# Altium schematic sheet 主板.SchDoc
size A2
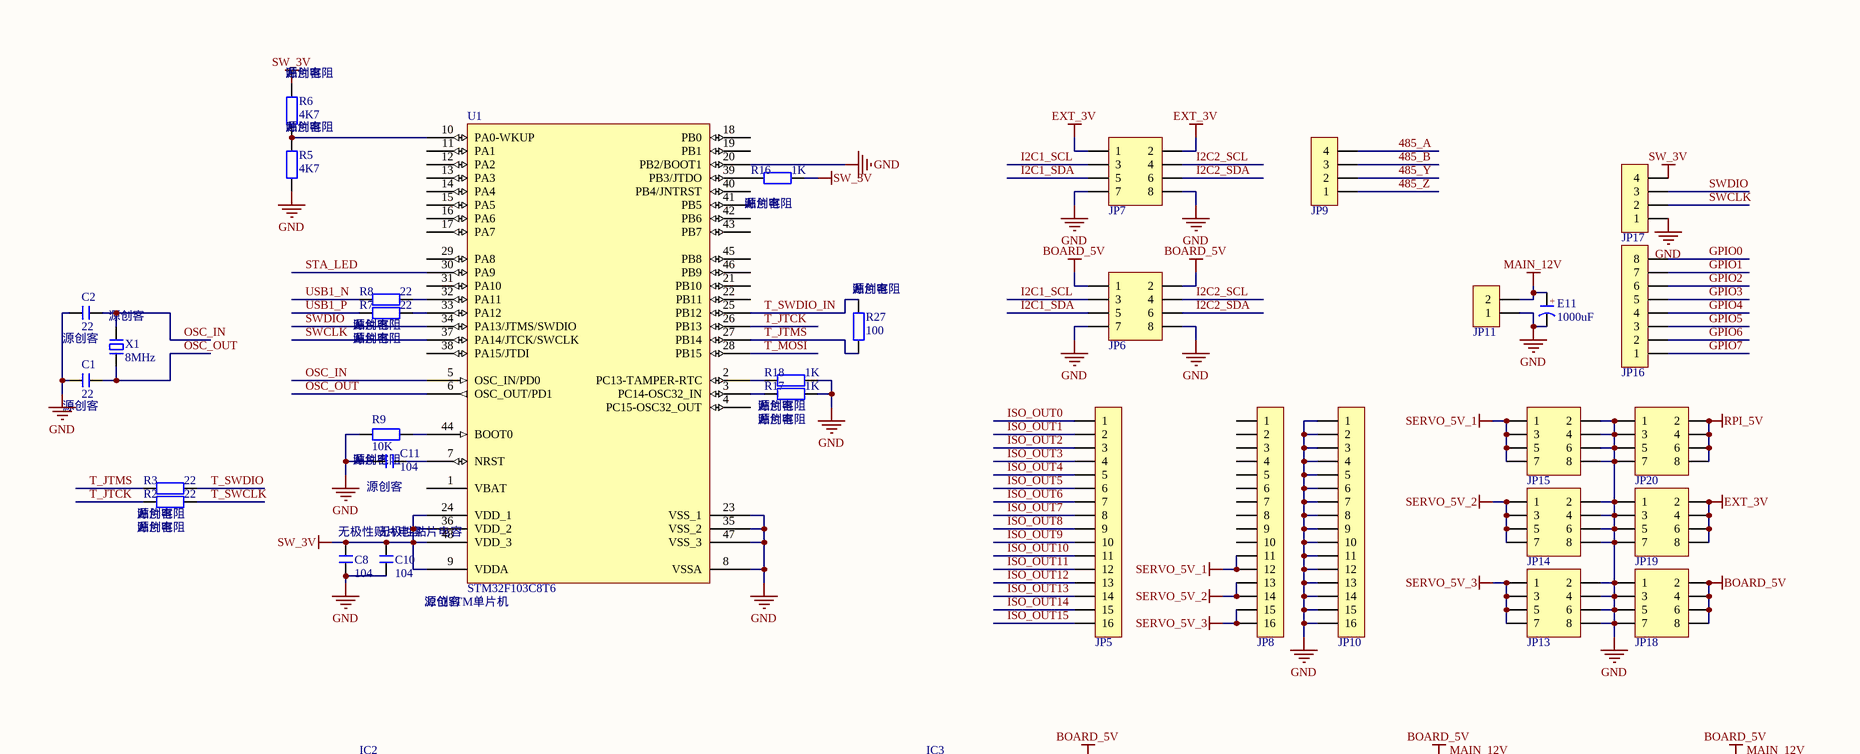
[diagram p0: 主板.SchDoc, top left]
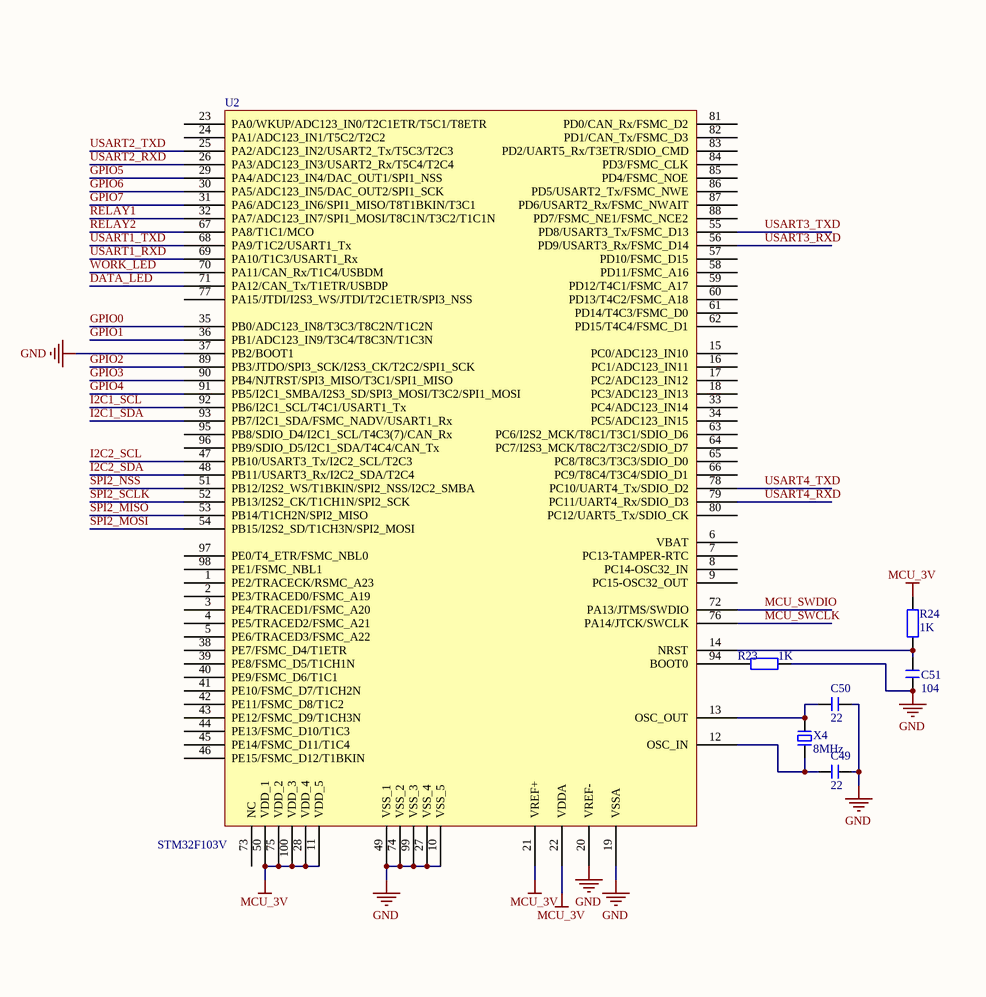
[diagram p1: 主板.SchDoc, top right]
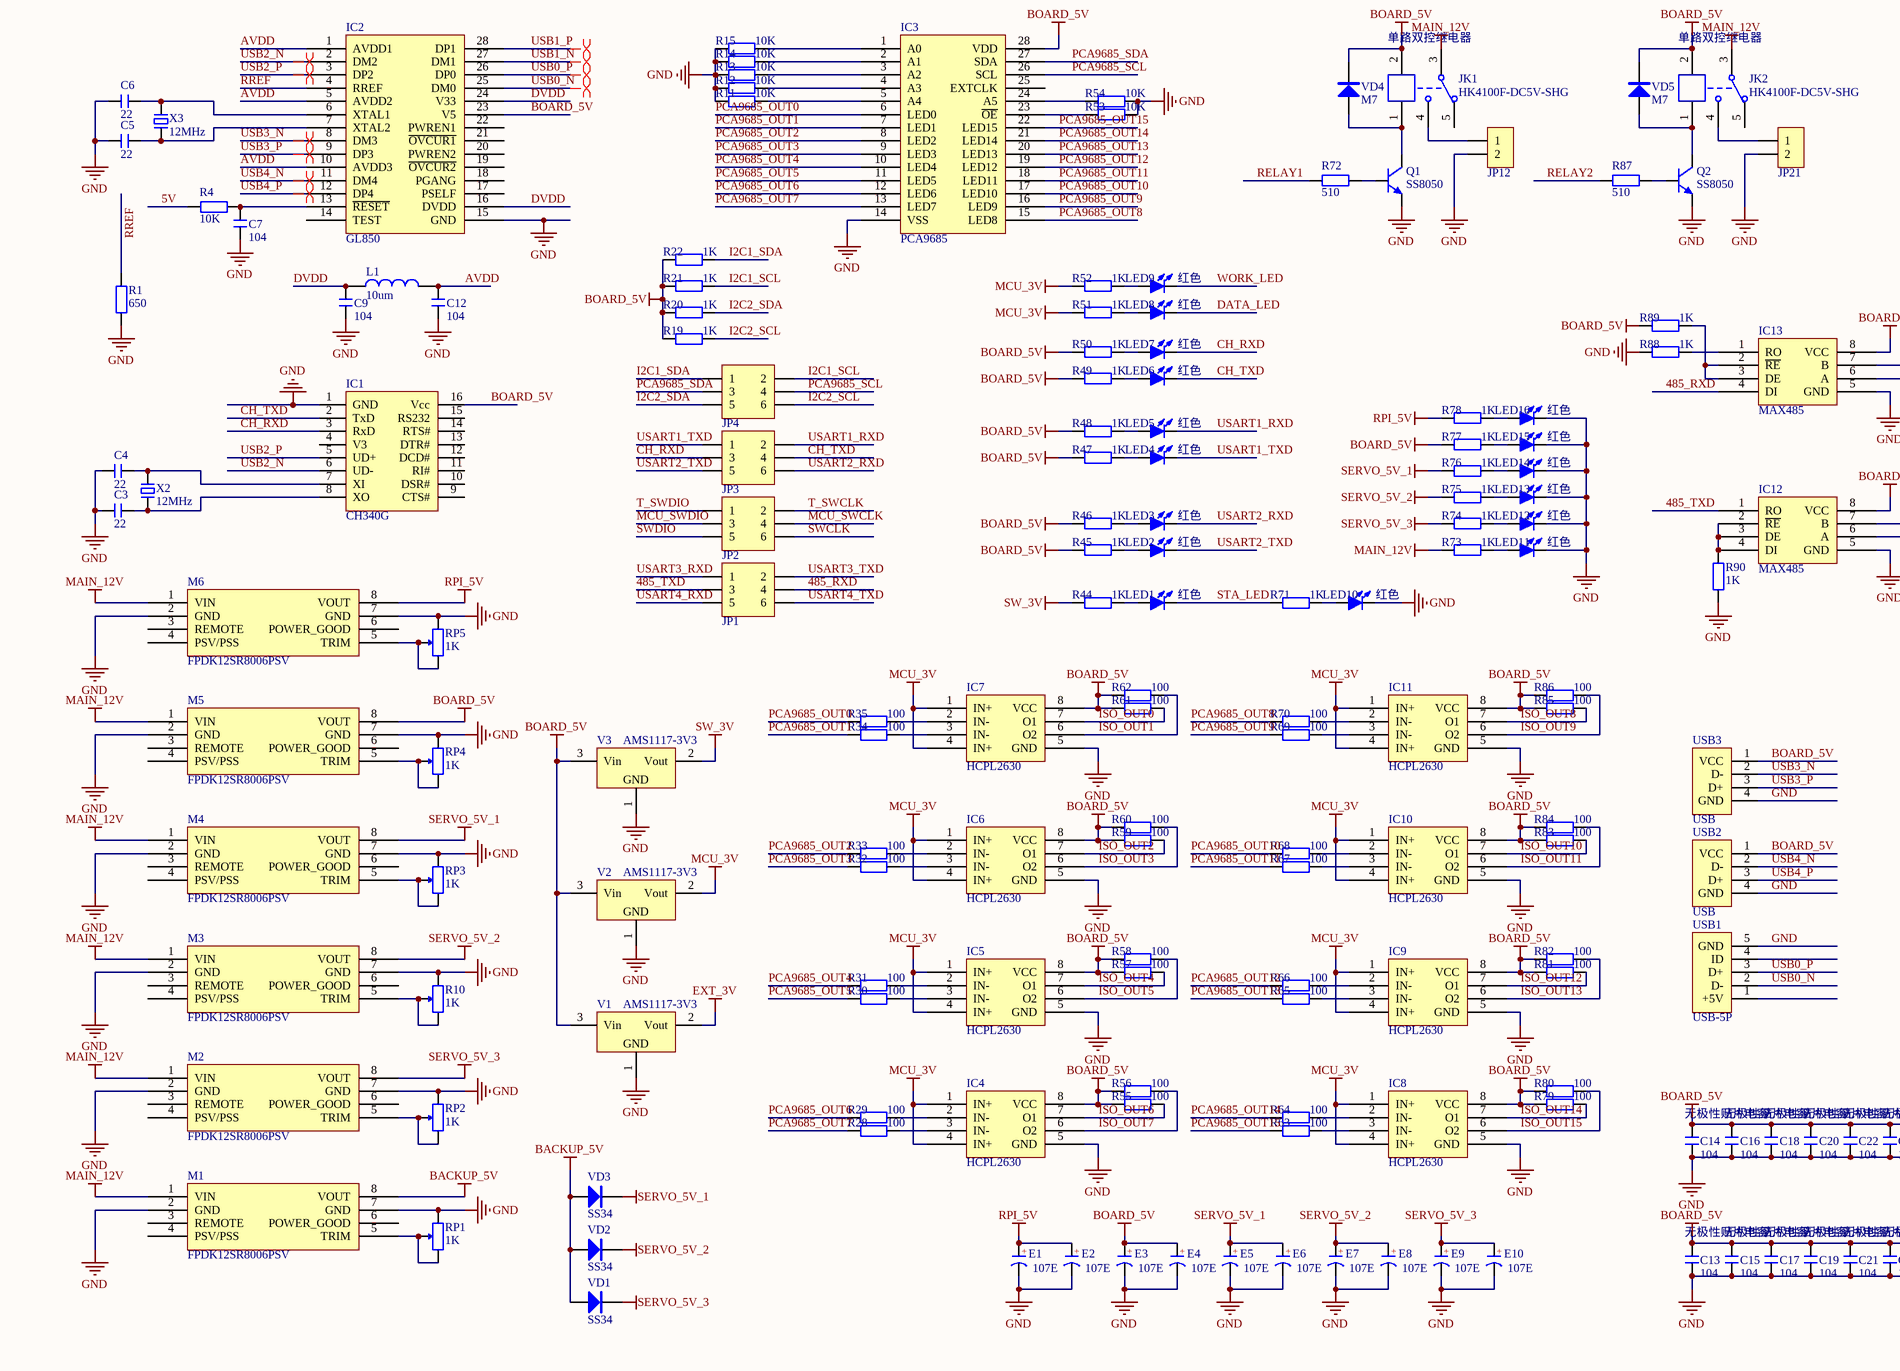
[diagram p2: 主板.SchDoc, bottom left]
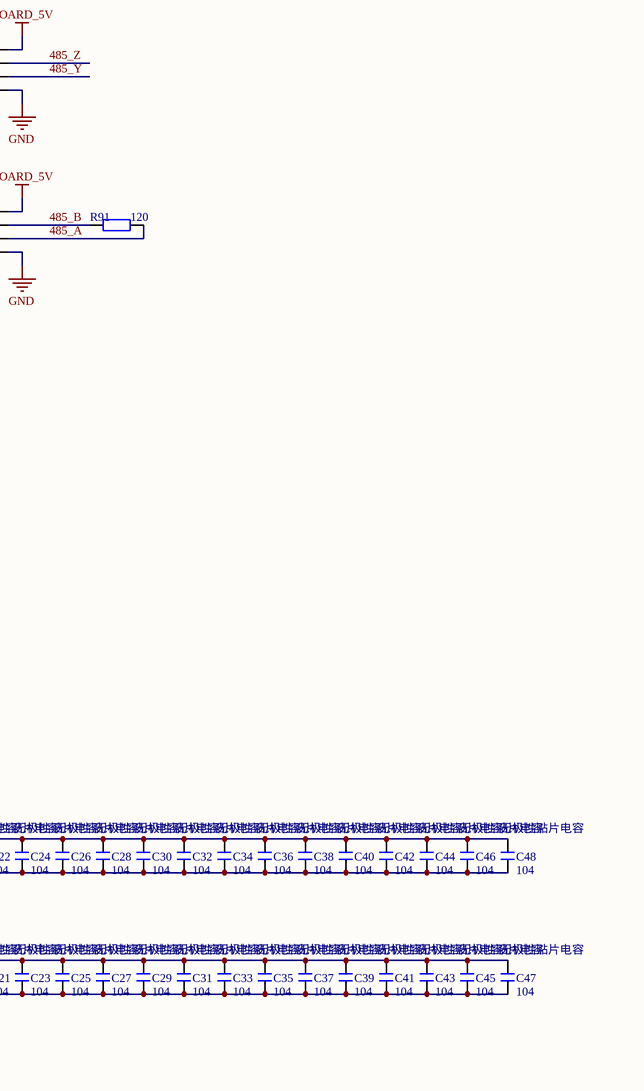
[diagram p3: 主板.SchDoc, bottom right]

## Parts
C1  22  [C 0201]
C2  22  [C 0201]
C3  22  [C 0201]
C4  22  [C 0201]
C5  22  [C 0201]
C6  22  [C 0201]
C7  104  [C 0201]
C8  104  [C 0201]
C9  104  [C 0201]
C10  104  [C 0201]
C11  104  [C 0201]
C12  104  [C 0201]
C13  104  [C 0201]
C14  104  [C 0201]
C15  104  [C 0201]
C16  104  [C 0201]
C17  104  [C 0201]
C18  104  [C 0201]
C19  104  [C 0201]
C20  104  [C 0201]
C21  104  [C 0201]
C22  104  [C 0201]
C23  104  [C 0201]
C24  104  [C 0201]
C25  104  [C 0201]
C26  104  [C 0201]
C27  104  [C 0201]
C28  104  [C 0201]
C29  104  [C 0201]
C30  104  [C 0201]
C31  104  [C 0201]
C32  104  [C 0201]
C33  104  [C 0201]
C34  104  [C 0201]
C35  104  [C 0201]
C36  104  [C 0201]
C37  104  [C 0201]
C38  104  [C 0201]
C39  104  [C 0201]
C40  104  [C 0201]
C41  104  [C 0201]
C42  104  [C 0201]
C43  104  [C 0201]
C44  104  [C 0201]
C45  104  [C 0201]
C46  104  [C 0201]
C47  104  [C 0201]
C48  104  [C 0201]
C49  22  [C 0201]
C50  22  [C 0201]
C51  104  [C 0201]
E1  107E  [CD A(3216)]
E2  107E  [CD A(3216)]
E3  107E  [CD A(3216)]
E4  107E  [CD A(3216)]
E5  107E  [CD A(3216)]
E6  107E  [CD A(3216)]
E7  107E  [CD A(3216)]
E8  107E  [CD A(3216)]
E9  107E  [CD A(3216)]
E10  107E  [CD A(3216)]
E11  1000uF  [CS 2.0*5*8 - C]
IC1  CH340G  [SOP16_L]
IC2  GL850  [SSOP28_M]
IC3  PCA9685  [TSSOP28_M]
IC4  HCPL2630  [DIP8-300]
IC5  HCPL2630  [DIP8-300]
IC6  HCPL2630  [DIP8-300]
IC7  HCPL2630  [DIP8-300]
IC8  HCPL2630  [DIP8-300]
IC9  HCPL2630  [DIP8-300]
IC10  HCPL2630  [DIP8-300]
IC11  HCPL2630  [DIP8-300]
IC12  MAX485  [SOP8W_M]
IC13  MAX485  [SOP8W_M]
JK1  HK4100F-DC5V-SHG  [HK4100F]
JK2  HK4100F-DC5V-SHG  [HK4100F]
JP1  Header3X2  [HDR-3X2]  (value not drawn)
JP2  Header3X2  [HDR-3X2]  (value not drawn)
JP3  Header3X2  [HDR-3X2]  (value not drawn)
JP4  Header3X2  [HDR-3X2]  (value not drawn)
JP5  HDR-1X16  [HDR-1X16]  (value not drawn)
JP6  Header 4X2  [HDR-4X2]  (value not drawn)
JP7  Header 4X2  [HDR-4X2]  (value not drawn)
JP8  HDR-1X16  [HDR-1X16]  (value not drawn)
JP9  HDR-1X4  [HDR-1X4]  (value not drawn)
JP10  HDR-1X16  [HDR-1X16]  (value not drawn)
JP11  HDR-1X2  [HDR-1X2]  (value not drawn)
JP12  HDR-1X2  [HDR-1X2]  (value not drawn)
JP13  Header 4X2  [HDR-4X2]  (value not drawn)
JP14  Header 4X2  [HDR-4X2]  (value not drawn)
JP15  Header 4X2  [HDR-4X2]  (value not drawn)
JP16  HDR-1X8  [HDR-1X8]  (value not drawn)
JP17  HDR-1X4  [HDR-1X4]  (value not drawn)
JP18  Header 4X2  [HDR-4X2]  (value not drawn)
JP19  Header 4X2  [HDR-4X2]  (value not drawn)
JP20  Header 4X2  [HDR-4X2]  (value not drawn)
JP21  HDR-1X2  [HDR-1X2]  (value not drawn)
L1  10um  [L 0402]
LED1  红色  [LED 0603W]
LED2  红色  [LED 0603W]
LED3  红色  [LED 0603W]
LED4  红色  [LED 0603W]
LED5  红色  [LED 0603W]
LED6  红色  [LED 0603W]
LED7  红色  [LED 0603W]
LED8  红色  [LED 0603W]
LED9  红色  [LED 0603W]
LED10  红色  [LED 0603W]
LED11  红色  [LED 0603W]
LED12  红色  [LED 0603W]
LED13  红色  [LED 0603W]
LED14  红色  [LED 0603W]
LED15  红色  [LED 0603W]
LED16  红色  [LED 0603W]
M1  FPDK12SR8006PSV  [FPDK12SR8006PSV]
M2  FPDK12SR8006PSV  [FPDK12SR8006PSV]
M3  FPDK12SR8006PSV  [FPDK12SR8006PSV]
M4  FPDK12SR8006PSV  [FPDK12SR8006PSV]
M5  FPDK12SR8006PSV  [FPDK12SR8006PSV]
M6  FPDK12SR8006PSV  [FPDK12SR8006PSV]
Q1  SS8050  [SOT23-3N]
Q2  SS8050  [SOT23-3N]
R1  650  [R 0201]
R2  22  [R 0201]
R3  22  [R 0201]
R4  10K  [R 0201]
R5  4K7  [R 0201]
R6  4K7  [R 0201]
R7  22  [R 0201]
R8  22  [R 0201]
R9  10K  [R 0201]
R10  1K  [3296W]
R11  10K  [R 0201]
R12  10K  [R 0201]
R13  10K  [R 0201]
R14  10K  [R 0201]
R15  10K  [R 0201]
R16  1K  [R 0201]
R17  1K  [R 0201]
R18  1K  [R 0201]
R19  1K  [R 0201]
R20  1K  [R 0201]
R21  1K  [R 0201]
R22  1K  [R 0201]
R23  1K  [R 0201]
R24  1K  [R 0201]
R27  100  [R 0201]
R28  100  [R 0201]
R29  100  [R 0201]
R30  100  [R 0201]
R31  100  [R 0201]
R32  100  [R 0201]
R33  100  [R 0201]
R34  100  [R 0201]
R35  100  [R 0201]
R44  1K  [R 0201]
R45  1K  [R 0201]
R46  1K  [R 0201]
R47  1K  [R 0201]
R48  1K  [R 0201]
R49  1K  [R 0201]
R50  1K  [R 0201]
R51  1K  [R 0201]
R52  1K  [R 0201]
R53  10K  [R 0201]
R54  10K  [R 0201]
R55  100  [R 0201]
R56  100  [R 0201]
R57  100  [R 0201]
R58  100  [R 0201]
R59  100  [R 0201]
R60  100  [R 0201]
R61  100  [R 0201]
R62  100  [R 0201]
R63  100  [R 0201]
R64  100  [R 0201]
R65  100  [R 0201]
R66  100  [R 0201]
R67  100  [R 0201]
R68  100  [R 0201]
R69  100  [R 0201]
R70  100  [R 0201]
R71  1K  [R 0201]
R72  510  [R 0201]
R73  1K  [R 0201]
R74  1K  [R 0201]
R75  1K  [R 0201]
R76  1K  [R 0201]
R77  1K  [R 0201]
R78  1K  [R 0201]
R79  100  [R 0201]
R80  100  [R 0201]
R81  100  [R 0201]
R82  100  [R 0201]
R83  100  [R 0201]
R84  100  [R 0201]
R85  100  [R 0201]
R86  100  [R 0201]
R87  510  [R 0201]
R88  1K  [R 0201]
R89  1K  [R 0201]
R90  1K  [R 0201]
R91  120  [R 0201]
RP1  1K  [3296W]
RP2  1K  [3296W]
RP3  1K  [3296W]
RP4  1K  [3296W]
RP5  1K  [3296W]
U1  STM32F103C8T6  [LQFP48 7X7_N]
U2  STM32F103V  [LQFP100 14X14_L]
USB1  USB-5P  [USB-MICRO_A]
USB2  USB  [USB-A/S_B]
USB3  USB  [USB-A/S_B]
V1  AMS1117-3V3  [SOT223_L]
V2  AMS1117-3V3  [SOT223_L]
V3  AMS1117-3V3  [SOT223_L]
VD1  SS34  [SMC]
VD2  SS34  [SMC]
VD3  SS34  [SMC]
VD4  M7  [SMA]
VD5  M7  [SMA]
X1  8MHz  [XTAL-49S DIP]
X2  12MHz  [XTAL-49S DIP]
X3  12MHz  [XTAL-49S DIP]
X4  8MHz  [XTAL-49S DIP]

## Nets
BACKUP_5V: M1.8(VOUT) VD1.1(A) VD2.1(A) VD3.1(A)
BOARD_5V: C13.2 C14.2 C15.2 C16.2 C17.2 C18.2 C19.2 C20.2 C21.2 C22.2 C23.2 C24.2 C25.2 C26.2 C27.2 C28.2 C29.2 C30.2 C31.2 C32.2 C33.2 C34.2 C35.2 C36.2 C37.2 C38.2 C39.2 C40.2 C41.2 C42.2 C43.2 C44.2 C45.2 C46.2 C47.2 C48.2 E3.1(A) E4.1(A) IC1.16(Vcc) IC2.23(V5) IC3.28(VDD) IC4.8(VCC) IC5.8(VCC) IC6.8(VCC) IC7.8(VCC) IC8.8(VCC) IC9.8(VCC) IC10.8(VCC) IC11.8(VCC) IC12.8(VCC) IC13.8(VCC) JK1.2 JK2.2 JP6.1 JP6.2 JP18.2 JP18.4 JP18.6 JP18.8 M5.8(VOUT) R19.2 R20.2 R21.2 R22.2 R45.2 R46.2 R47.2 R48.2 R49.2 R50.2 R55.1 R56.1 R57.1 R58.1 R59.1 R60.1 R61.1 R62.1 R77.2 R79.1 R80.1 R81.1 R82.1 R83.1 R84.1 R85.1 R86.1 R89.1 USB2.1(VCC) USB3.1(VCC) V1.3(Vin) V2.3(Vin) V3.3(Vin) VD4.2(K) VD5.2(K)
EXT_3V: JP7.1 JP7.2 JP19.2 JP19.4 JP19.6 JP19.8 V1.2(Vout)
GND: C1.1 C2.1 C3.1 C4.1 C5.1 C6.1 C7.1 C8.1 C9.1 C10.1 C11.1 C12.1 C13.1 C14.1 C15.1 C16.1 C17.1 C18.1 C19.1 C20.1 C21.1 C22.1 C23.1 C24.1 C25.1 C26.1 C27.1 C28.1 C29.1 C30.1 C31.1 C32.1 C33.1 C34.1 C35.1 C36.1 C37.1 C38.1 C39.1 C40.1 C41.1 C42.1 C43.1 C44.1 C45.1 C46.1 C47.1 C48.1 C49.1 C50.1 C51.1 E1.2(K) E2.2(K) E3.2(K) E4.2(K) E5.2(K) E6.2(K) E7.2(K) E8.2(K) E9.2(K) E10.2(K) E11.2(K) IC1.1(GND) IC2.15(GND) IC3.14(VSS) IC4.5(GND) IC5.5(GND) IC6.5(GND) IC7.5(GND) IC8.5(GND) IC9.5(GND) IC10.5(GND) IC11.5(GND) IC12.5(GND) IC13.5(GND) JP6.7 JP6.8 JP7.7 JP7.8 JP10.1 JP10.2 JP10.3 JP10.4 JP10.5 JP10.6 JP10.7 JP10.8 JP10.9 JP10.10 JP10.11 JP10.12 JP10.13 JP10.14 JP10.15 JP10.16 JP11.1 JP12.2 JP13.2 JP13.4 JP13.6 JP13.8 JP14.2 JP14.4 JP14.6 JP14.8 JP15.2 JP15.4 JP15.6 JP15.8 JP17.1 JP18.1 JP18.3 JP18.5 JP18.7 JP19.1 JP19.3 JP19.5 JP19.7 JP20.1 JP20.3 JP20.5 JP20.7 JP21.2 LED10.2(K) LED11.2(K) LED12.2(K) LED13.2(K) LED14.2(K) LED15.2(K) LED16.2(K) M1.2(GND) M1.7(GND) M2.2(GND) M2.7(GND) M3.2(GND) M3.7(GND) M4.2(GND) M4.7(GND) M5.2(GND) M5.7(GND) M6.2(GND) M6.7(GND) Q1.2(E) Q2.2(E) R1.1 R5.1 R9.1 R10.3 R11.1 R12.1 R13.1 R14.1 R15.1 R17.2 R18.2 R23.2 R53.2 R54.2 R88.2 R90.1 RP1.3 RP2.3 RP3.3 RP4.3 RP5.3 U1.8(VSSA) U1.20(PB2/BOOT1) U1.23(VSS_1) U1.35(VSS_2) U1.47(VSS_3) U2.10(VSS_5) U2.19(VSSA) U2.20(VREF-) U2.27(VSS_4) U2.37(PB2/BOOT1) U2.49(VSS_1) U2.74(VSS_2) U2.99(VSS_3) USB1.5(GND) USB2.4(GND) USB3.4(GND) V1.1(GND) V2.1(GND) V3.1(GND)
MAIN_12V: E11.1(A) JK1.3 JK2.3 JP11.2 M1.1(VIN) M2.1(VIN) M3.1(VIN) M4.1(VIN) M5.1(VIN) M6.1(VIN) R73.2
MCU_3V: IC4.1(IN+) IC4.4(IN+) IC5.1(IN+) IC5.4(IN+) IC6.1(IN+) IC6.4(IN+) IC7.1(IN+) IC7.4(IN+) IC8.1(IN+) IC8.4(IN+) IC9.1(IN+) IC9.4(IN+) IC10.1(IN+) IC10.4(IN+) IC11.1(IN+) IC11.4(IN+) R24.2 R51.2 R52.2 U2.11(VDD_5) U2.21(VREF+) U2.22(VDDA) U2.28(VDD_4) U2.50(VDD_1) U2.75(VDD_2) U2.100(VDD_3) V2.2(Vout)
RPI_5V: E1.1(A) E2.1(A) JP20.2 JP20.4 JP20.6 JP20.8 M6.8(VOUT) R78.2
SERVO_5V_1: E5.1(A) E6.1(A) JP8.11 JP8.12 JP15.1 JP15.3 JP15.5 JP15.7 M4.8(VOUT) R76.2 VD3.2(K)
SERVO_5V_2: E7.1(A) E8.1(A) JP8.13 JP8.14 JP14.1 JP14.3 JP14.5 JP14.7 M3.8(VOUT) R75.2 VD2.2(K)
SERVO_5V_3: E9.1(A) E10.1(A) JP8.15 JP8.16 JP13.1 JP13.3 JP13.5 JP13.7 M2.8(VOUT) R74.2 VD1.2(K)
SW_3V: C8.2 C10.2 JP17.4 R6.2 R16.2 R44.2 U1.9(VDDA) U1.24(VDD_1) U1.36(VDD_2) U1.48(VDD_3) V3.2(Vout)
5V: R4.1
485_A: IC12.6(A) JP9.4 R91.1
485_B: IC12.7(B) JP9.3 R91.2
485_RXD: IC13.4(DI) JP1.4
485_TXD: IC12.1(RO) JP1.3
485_Y: IC13.6(A) JP9.2
485_Z: IC13.7(B) JP9.1
AVDD: C12.2 IC2.1(AVDD1) IC2.5(AVDD2) IC2.10(AVDD3) L1.2
CH_RXD: IC1.3(RxD) JP3.3 LED7.2(K)
CH_TXD: IC1.2(TxD) JP3.4 LED6.2(K)
DATA_LED: LED8.2(K) U2.71(PA12/CAN_Tx/T1ETR/USBDP)
DVDD: C9.2 IC2.16(DVDD) IC2.24(V33) L1.1
GPIO0: JP16.8 U2.35(PB0/ADC123_IN8/T3C3/T8C2N/T1C2N)
GPIO1: JP16.7 U2.36(PB1/ADC123_IN9/T3C4/T8C3N/T1C3N)
GPIO2: JP16.6 U2.89(PB3/JTDO/SPI3_SCK/I2S3_CK/T2C2/SPI1_SCK)
GPIO3: JP16.5 U2.90(PB4/NJTRST/SPI3_MISO/T3C1/SPI1_MISO)
GPIO4: JP16.4 U2.91(PB5/I2C1_SMBA/I2S3_SD/SPI3_MOSI/T3C2/SPI1_MOSI)
GPIO5: JP16.3 U2.29(PA4/ADC123_IN4/DAC_OUT1/SPI1_NSS)
GPIO6: JP16.2 U2.30(PA5/ADC123_IN5/DAC_OUT2/SPI1_SCK)
GPIO7: JP16.1 U2.31(PA6/ADC123_IN6/SPI1_MISO/T8T1BKIN/T3C1)
I2C1_SCL: JP4.2 JP6.3 JP7.3 R21.1 U2.92(PB6/I2C1_SCL/T4C1/USART1_Tx)
I2C1_SDA: JP4.1 JP6.5 JP7.5 R22.1 U2.93(PB7/I2C1_SDA/FSMC_NADV/USART1_Rx)
I2C2_SCL: JP4.6 JP6.4 JP7.4 R19.1 U2.47(PB10/USART3_Tx/I2C2_SCL/T2C3)
I2C2_SDA: JP4.5 JP6.6 JP7.6 R20.1 U2.48(PB11/USART3_Rx/I2C2_SDA/T2C4)
ISO_OUT0: IC7.7(O1) JP5.1 R61.2
ISO_OUT1: IC7.6(O2) JP5.2 R62.2
ISO_OUT2: IC6.7(O1) JP5.3 R59.2
ISO_OUT3: IC6.6(O2) JP5.4 R60.2
ISO_OUT4: IC5.7(O1) JP5.5 R57.2
ISO_OUT5: IC5.6(O2) JP5.6 R58.2
ISO_OUT6: IC4.7(O1) JP5.7 R55.2
ISO_OUT7: IC4.6(O2) JP5.8 R56.2
ISO_OUT8: IC11.7(O1) JP5.9 R85.2
ISO_OUT9: IC11.6(O2) JP5.10 R86.2
ISO_OUT10: IC10.7(O1) JP5.11 R83.2
ISO_OUT11: IC10.6(O2) JP5.12 R84.2
ISO_OUT12: IC9.7(O1) JP5.13 R81.2
ISO_OUT13: IC9.6(O2) JP5.14 R82.2
ISO_OUT14: IC8.7(O1) JP5.15 R79.2
ISO_OUT15: IC8.6(O2) JP5.16 R80.2
MCU_SWCLK: JP2.4 U2.76(PA14/JTCK/SWCLK)
MCU_SWDIO: JP2.3 U2.72(PA13/JTMS/SWDIO)
OSC_IN: C2.2 U1.5(OSC_IN/PD0) X1.2
OSC_OUT: C1.2 U1.6(OSC_OUT/PD1) X1.1
PCA9685_OUT0: IC3.6(LED0) R35.1
PCA9685_OUT1: IC3.7(LED1) R34.1
PCA9685_OUT2: IC3.8(LED2) R33.1
PCA9685_OUT3: IC3.9(LED3) R32.1
PCA9685_OUT4: IC3.10(LED4) R31.1
PCA9685_OUT5: IC3.11(LED5) R30.1
PCA9685_OUT6: IC3.12(LED6) R29.1
PCA9685_OUT7: IC3.13(LED7) R28.1
PCA9685_OUT8: IC3.15(LED8) R70.1
PCA9685_OUT9: IC3.16(LED9) R69.1
PCA9685_OUT10: IC3.17(LED10) R68.1
PCA9685_OUT11: IC3.18(LED11) R67.1
PCA9685_OUT12: IC3.19(LED12) R66.1
PCA9685_OUT13: IC3.20(LED13) R65.1
PCA9685_OUT14: IC3.21(LED14) R64.1
PCA9685_OUT15: IC3.22(LED15) R63.1
PCA9685_SCL: IC3.26(SCL) JP4.4
PCA9685_SDA: IC3.27(SDA) JP4.3
RELAY1: R72.1 U2.32(PA7/ADC123_IN7/SPI1_MOSI/T8C1N/T3C2/T1C1N)
RELAY2: R87.1 U2.67(PA8/T1C1/MCO)
RREF: IC2.4(RREF) R1.2
SPI2_MISO: U2.53(PB14/T1CH2N/SPI2_MISO)
SPI2_MOSI: U2.54(PB15/I2S2_SD/T1CH3N/SPI2_MOSI)
SPI2_NSS: U2.51(PB12/I2S2_WS/T1BKIN/SPI2_NSS/I2C2_SMBA)
SPI2_SCLK: U2.52(PB13/I2S2_CK/T1CH1N/SPI2_SCK)
STA_LED: LED1.2(K) R71.2 U1.30(PA9)
SWCLK: JP2.6 JP17.2 U1.37(PA14/JTCK/SWCLK)
SWDIO: JP2.5 JP17.3 U1.34(PA13/JTMS/SWDIO)
T_JTCK: R2.1 U1.26(PB13)
T_JTMS: R3.1 R27.1 U1.27(PB14)
T_MOSI: U1.28(PB15)
T_SWCLK: JP2.2 R2.2
T_SWDIO: JP2.1 R3.2
T_SWDIO_IN: R27.2 U1.25(PB12)
USART1_RXD: JP3.2 LED5.2(K) U2.69(PA10/T1C3/USART1_Rx)
USART1_TXD: JP3.1 LED4.2(K) U2.68(PA9/T1C2/USART1_Tx)
USART2_RXD: JP3.6 LED3.2(K) U2.26(PA3/ADC123_IN3/USART2_Rx/T5C4/T2C4)
USART2_TXD: JP3.5 LED2.2(K) U2.25(PA2/ADC123_IN2/USART2_Tx/T5C3/T2C3)
USART3_RXD: JP1.1 U2.56(PD9/USART3_Rx/FSMC_D14)
USART3_TXD: JP1.2 U2.55(PD8/USART3_Tx/FSMC_D13)
USART4_RXD: JP1.5 U2.79(PC11/UART4_Rx/SDIO_D3)
USART4_TXD: JP1.6 U2.78(PC10/UART4_Tx/SDIO_D2)
USB0_N: IC2.25(DM0) USB1.2(D-)
USB0_P: IC2.26(DP0) USB1.3(D+)
USB1_N: IC2.27(DM1) R8.1
USB1_P: IC2.28(DP1) R7.1
USB2_N: IC1.6(UD-) IC2.2(DM2)
USB2_P: IC1.5(UD+) IC2.3(DP2)
USB3_N: IC2.8(DM3) USB3.2(D-)
USB3_P: IC2.9(DP3) USB3.3(D+)
USB4_N: IC2.11(DM4) USB2.2(D-)
USB4_P: IC2.12(DP4) USB2.3(D+)
WORK_LED: LED9.2(K) U2.70(PA11/CAN_Rx/T1C4/USBDM)
NetC3_2: C3.2 IC1.8(XO) X2.1
NetC4_2: C4.2 IC1.7(XI) X2.2
NetC5_2: C5.2 IC2.7(XTAL2) X3.2
NetC6_2: C6.2 IC2.6(XTAL1) X3.1
NetC7_2: C7.2 IC2.13(~{RESET}) R4.2
NetC11_2: C11.2 U1.7(NRST)
NetC49_2: C49.2 U2.12(OSC_IN) X4.1
NetC50_2: C50.2 U2.13(OSC_OUT) X4.2
NetC51_2: C51.2 R24.1 U2.14(NRST)
NetIC3_1: IC3.1(A0) R15.2
NetIC3_2: IC3.2(A1) R14.2
NetIC3_3: IC3.3(A2) R13.2
NetIC3_4: IC3.4(A3) R12.2
NetIC3_5: IC3.5(A4) R11.2
NetIC3_23: IC3.23(~{OE}) R53.1
NetIC3_24: IC3.24(A5) R54.1
NetIC4_2: IC4.2(IN-) R29.2
NetIC4_3: IC4.3(IN-) R28.2
NetIC5_2: IC5.2(IN-) R31.2
NetIC5_3: IC5.3(IN-) R30.2
NetIC6_2: IC6.2(IN-) R33.2
NetIC6_3: IC6.3(IN-) R32.2
NetIC7_2: IC7.2(IN-) R35.2
NetIC7_3: IC7.3(IN-) R34.2
NetIC8_2: IC8.2(IN-) R64.2
NetIC8_3: IC8.3(IN-) R63.2
NetIC9_2: IC9.2(IN-) R66.2
NetIC9_3: IC9.3(IN-) R65.2
NetIC10_2: IC10.2(IN-) R68.2
NetIC10_3: IC10.3(IN-) R67.2
NetIC11_2: IC11.2(IN-) R70.2
NetIC11_3: IC11.3(IN-) R69.2
NetIC12_2: IC12.2(~{RE}) IC12.3(DE) IC12.4(DI) R90.2
NetIC13_1: IC13.1(RO) R88.1
NetIC13_2: IC13.2(~{RE}) IC13.3(DE) R89.2
NetJK1_1: JK1.1 Q1.3(C) VD4.1(A)
NetJK1_4: JK1.4 JP12.1
NetJK2_1: JK2.1 Q2.3(C) VD5.1(A)
NetJK2_4: JK2.4 JP21.1
NetLED1_1: LED1.1(A) R44.1
NetLED2_1: LED2.1(A) R45.1
NetLED3_1: LED3.1(A) R46.1
NetLED4_1: LED4.1(A) R47.1
NetLED5_1: LED5.1(A) R48.1
NetLED6_1: LED6.1(A) R49.1
NetLED7_1: LED7.1(A) R50.1
NetLED8_1: LED8.1(A) R51.1
NetLED9_1: LED9.1(A) R52.1
NetLED10_1: LED10.1(A) R71.1
NetLED11_1: LED11.1(A) R73.1
NetLED12_1: LED12.1(A) R74.1
NetLED13_1: LED13.1(A) R75.1
NetLED14_1: LED14.1(A) R76.1
NetLED15_1: LED15.1(A) R77.1
NetLED16_1: LED16.1(A) R78.1
NetM1_5: M1.5(TRIM) RP1.1 RP1.2
NetM2_5: M2.5(TRIM) RP2.1 RP2.2
NetM3_5: M3.5(TRIM) R10.1 R10.2
NetM4_5: M4.5(TRIM) RP3.1 RP3.2
NetM5_5: M5.5(TRIM) RP4.1 RP4.2
NetM6_5: M6.5(TRIM) RP5.1 RP5.2
NetQ1_1: Q1.1(B) R72.2
NetQ2_1: Q2.1(B) R87.2
NetR5_2: R5.2 R6.1 U1.10(PA0-WKUP)
NetR7_2: R7.2 U1.33(PA12)
NetR8_2: R8.2 U1.32(PA11)
NetR9_2: R9.2 U1.44(BOOT0)
NetR16_1: R16.1 U1.39(PB3/JTDO)
NetR17_1: R17.1 U1.3(PC14-OSC32_IN)
NetR18_1: R18.1 U1.2(PC13-TAMPER-RTC)
NetR23_1: R23.1 U2.94(BOOT0)

Not connected (* = marked no-connect by the designer): IC1 4(V3) 9(CTS#) 10(DSR#) 11(RI#) 12(DCD#) 13(DTR#) 14(RTS#) 15(RS232); IC2 14(TEST) 17(PSELF) 18(PGANG) 19(~{OVCUR2}) 20(PWREN2) 21(~{OVCUR1}) 22(PWREN1); IC3 25(EXTCLK); JK1 5; JK2 5; JP8 1 2 3 4 5 6 7 8 9 10; M1 3(REMOTE) 4(PSV/PSS) 6(POWER_GOOD); M2 3(REMOTE) 4(PSV/PSS) 6(POWER_GOOD); M3 3(REMOTE) 4(PSV/PSS) 6(POWER_GOOD); M4 3(REMOTE) 4(PSV/PSS) 6(POWER_GOOD); M5 3(REMOTE) 4(PSV/PSS) 6(POWER_GOOD); M6 3(REMOTE) 4(PSV/PSS) 6(POWER_GOOD); U1 1(VBAT) 4(PC15-OSC32_OUT) 11(PA1) 12(PA2) 13(PA3) 14(PA4) 15(PA5) 16(PA6) 17(PA7) 18(PB0) 19(PB1) 21(PB10) 22(PB11) 29(PA8) 31(PA10) 38(PA15/JTDI) 40(PB4/JNTRST) 41(PB5) 42(PB6) 43(PB7) 45(PB8) 46(PB9); U2 1(PE2/TRACECK/RSMC_A23) 2(PE3/TRACED0/FSMC_A19) 3(PE4/TRACED1/FSMC_A20) 4(PE5/TRACED2/FSMC_A21) 5(PE6/TRACED3/FSMC_A22) 6(VBAT) 7(PC13-TAMPER-RTC) 8(PC14-OSC32_IN) 9(PC15-OSC32_OUT) 15(PC0/ADC123_IN10) 16(PC1/ADC123_IN11) 17(PC2/ADC123_IN12) 18(PC3/ADC123_IN13) 23(PA0/WKUP/ADC123_IN0/T2C1ETR/T5C1/T8ETR) 24(PA1/ADC123_IN1/T5C2/T2C2) 33(PC4/ADC123_IN14) 34(PC5/ADC123_IN15) 38(PE7/FSMC_D4/T1ETR) 39(PE8/FSMC_D5/T1CH1N) 40(PE9/FSMC_D6/T1C1) 41(PE10/FSMC_D7/T1CH2N) 42(PE11/FSMC_D8/T1C2) 43(PE12/FSMC_D9/T1CH3N) 44(PE13/FSMC_D10/T1C3) 45(PE14/FSMC_D11/T1C4) 46(PE15/FSMC_D12/T1BKIN) 57(PD10/FSMC_D15) 58(PD11/FSMC_A16) 59(PD12/T4C1/FSMC_A17) 60(PD13/T4C2/FSMC_A18) 61(PD14/T4C3/FSMC_D0) 62(PD15/T4C4/FSMC_D1) 63(PC6/I2S2_MCK/T8C1/T3C1/SDIO_D6) 64(PC7/I2S3_MCK/T8C2/T3C2/SDIO_D7) 65(PC8/T8C3/T3C3/SDIO_D0) 66(PC9/T8C4/T3C4/SDIO_D1) 73(NC) 77(PA15/JTDI/I2S3_WS/JTDI/T2C1ETR/SPI3_NSS) 80(PC12/UART5_Tx/SDIO_CK) 81(PD0/CAN_Rx/FSMC_D2) 82(PD1/CAN_Tx/FSMC_D3) 83(PD2/UART5_Rx/T3ETR/SDIO_CMD) 84(PD3/FSMC_CLK) 85(PD4/FSMC_NOE) 86(PD5/USART2_Tx/FSMC_NWE) 87(PD6/USART2_Rx/FSMC_NWAIT) 88(PD7/FSMC_NE1/FSMC_NCE2) 95(PB8/SDIO_D4/I2C1_SCL/T4C3(7)/CAN_Rx) 96(PB9/SDIO_D5/I2C1_SDA/T4C4/CAN_Tx) 97(PE0/T4_ETR/FSMC_NBL0) 98(PE1/FSMC_NBL1); USB1 1(+5V) 4(ID)

## Layout directives
differential pair: USB0_N, USB0_P, USB1_N, USB1_P, USB2_N, USB2_P, USB3_N, USB3_P, USB4_N, USB4_P

## Notes on the sheet
- (in symbol C) 源创客
- (in symbol C-CD) +
- (in symbol C-CS) +
- (in symbol R) 源创客
- (in symbol STM32F103C8T6) 32位STM单片机; 源创客
- (in symbol XTAL-2) 源创客

## Library data of the parts
C1 C2 C11 = C: 无极性贴片电容; 学习�: www.ooocke.com
C3-C7 C9 C12 C49 C50 = C: 无极性贴片电容; 版: 源创客; 学习资源|UNIQUEID: www.ooocke.com
C8 C10 C13-C48 = C: 无极性贴片电容; 版权归属|UNIQU: 源创客; 学习资源: www.ooocke.com
C51 = C: 无极性贴片电容; 版权归属: 源创客; BOM名称: 无极性贴片电容; 学习资源: www.ooocke.com
E1-E10 = C-CD: 贴片钽电容; 版权归属|UNIQU: 源创客; BOM名称|UNIQU: 贴片钽电容; 学习资源: www.ooocke.com
E11 = C-CS: 直插固态电容; 版权归属|UNIQU: 源创客; BOM名称|UNI: 直插固态电容; 学习资源: www.ooocke.com
IC1 = CH: 串口转USB; 版: 源创客; BOM: 串口转USB; 学习资源|UNIQUEID: www.ooocke.com
IC2 = GL850G: 4 Port USB HUB
IC4-IC11 = HCPL2630: 高速光电耦合器 10Mbit/s
IC12 IC13 = MAX485: 485通信芯片
JK1 JK2 = HK4100F: 单路双控继电器; 版权归属|UNIQU: 源创客; 学习资源: www.ooocke.com
JP1-JP4 = Heade: 3*2P接插件; 版: 源创客; BOM: 3*2P接插件; 学习资源|UNIQUEID: www.ooocke.com
JP5 JP8 JP10 = Header 16: 16P接插件; 版权归属|UNIQU: 源创客; BOM名称: 16P接插件; 学习资源: www.ooocke.com
JP6 JP7 JP13-JP15 JP18-JP20 = Header 4X2: 4*2P接插件; 版权归属|UNIQU: 源创客; BOM名称: 4*2P接插件; 学习资源: www.ooocke.com
JP9 JP17 = Header 4: 4P接插件; 版权归属|UNIQU: 源创客; BOM名称: 4P接插件; 学习资源: www.ooocke.com
JP11 JP12 JP21 = Header 2: 2P接插件; 版权归属|UNIQU: 源创客; BOM名称: 2P接插件; 学习资源: www.ooocke.com
JP16 = Header 8: 8P接插件; 版权归属|UNIQU: 源创客; BOM名称: 8P接插件; 学习资源: www.ooocke.com
L1 = L: 小功率贴片电感; 版: 源创客; 学习资源|UNIQUEID: www.ooocke.com
LED1-LED16 = LED-S: 贴片LED; 版权归属|UNIQU: 源创客; BOM名称: 贴片LED; 学习资源: www.ooocke.com
M1-M6 = FPDK12SR8006PSV: DC-DC POWER CONVERTOR 12V-TO-5V
Q1 Q2 = 8050-SMD: 高频放大-NPN型; 版权归属|UNIQU: 源创客; 属性: 40V 1.5A 1W 100MHZ; BOM名称|UNIQU: 高频放大-NPN型; 学习资源: www.ooocke.com
R1 R4 R11-R15 R53 R54 = R: 贴片电阻; 版: 源创客; BO: 贴片电阻; 学习资源|UNIQUEID: www.ooocke.com
R2 R3 R5-R9 R16-R18 R27 = R: 贴片电阻; 学习�: www.ooocke.com
R10 RP1-RP5 = RP-ID: 插件单联电位器; B: 插件电位器; 版: 源创客; 学习资源|UNIQUEID: www.ooocke.com
R19-R22 R28-R35 R44-R52 R55-R91 = R: 贴片电阻; 版权归属|UNIQU: 源创客; BOM名称|UNIQUEI: 贴片电阻; 学习资源: www.ooocke.com
R23 R24 = R: 贴片电阻; 版权归属: 源创客; BOM名称: 贴片电阻; 学习资源: www.ooocke.com
U1 = STM32F103C8T6: Flaah:64/RAM:20/IO:36; 学习�: www.ooocke.com
U2 = STM32F103V: 32位STM单片机100引脚; 版权归属|UNIQU: 源创客; BOM名称|UNI: 32位STM单片机100引脚; 学习资源: www.ooocke.com
USB1 = USB-5P: 微型USB母座; 版权归属|UNIQU: 源创客; BOM名称|UNIQUEI: 微型USB母座; 学习资源: www.ooocke.com
USB2 USB3 = USB-A/S: USB-A型母接口; 版权归属|UNIQU: 源创客; BOM名称|UNIQUEI: USB-A型母接口; 学习资源: www.ooocke.com
V1-V3 = AMS1117: 三端稳压芯片; BO: 稳压芯片; 版: 源创客; 学习资源|UNIQUEID: www.ooocke.com
VD1-VD3 = SS34: 肖特基二极管; 版权归属|UNIQU: 源创客; 属性: 40V/3A; BOM名称|UNI: 肖特基二极管; 学习资源: www.ooocke.com
VD4 VD5 = M7: 整流二极管; 版权归属|UNIQU: 源创客; BOM名称|UNIQU: 整流二极管; 学习资源: www.ooocke.com
X1 = XTAL-2: 2脚晶振; B: 2脚晶振; 学习�: www.ooocke.com
X2-X4 = XTAL-2: 2脚晶振; 版: 源创客; BOM: 2脚晶振; 学习资源|UNIQUEID: www.ooocke.com